# EAGLE schematic GimbalIMUBoard (EAGLE 8.7.0)
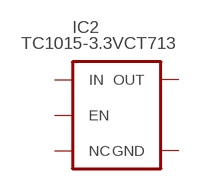
[diagram p0: schematic, sheet 1]

## Parts
IC2  TC1015-3.3VCT713  V_REG_TPS76433SOT23-5  [SOT23-5]
Unconnected: IC2.1(IN) IC2.2(GND) IC2.3(EN) IC2.4(NC) IC2.5(OUT)

## Library data of the parts
IC2 = # SparkFun2:V_REG_TPS76433: Voltage Regulator Older TI part. LDO 150mA regulator. No output by-pass cap option. See V_REG_LDO for a better part.